# EAGLE design PCRADIO-1 (EAGLE 4.15)

## Sheet 1 of 3
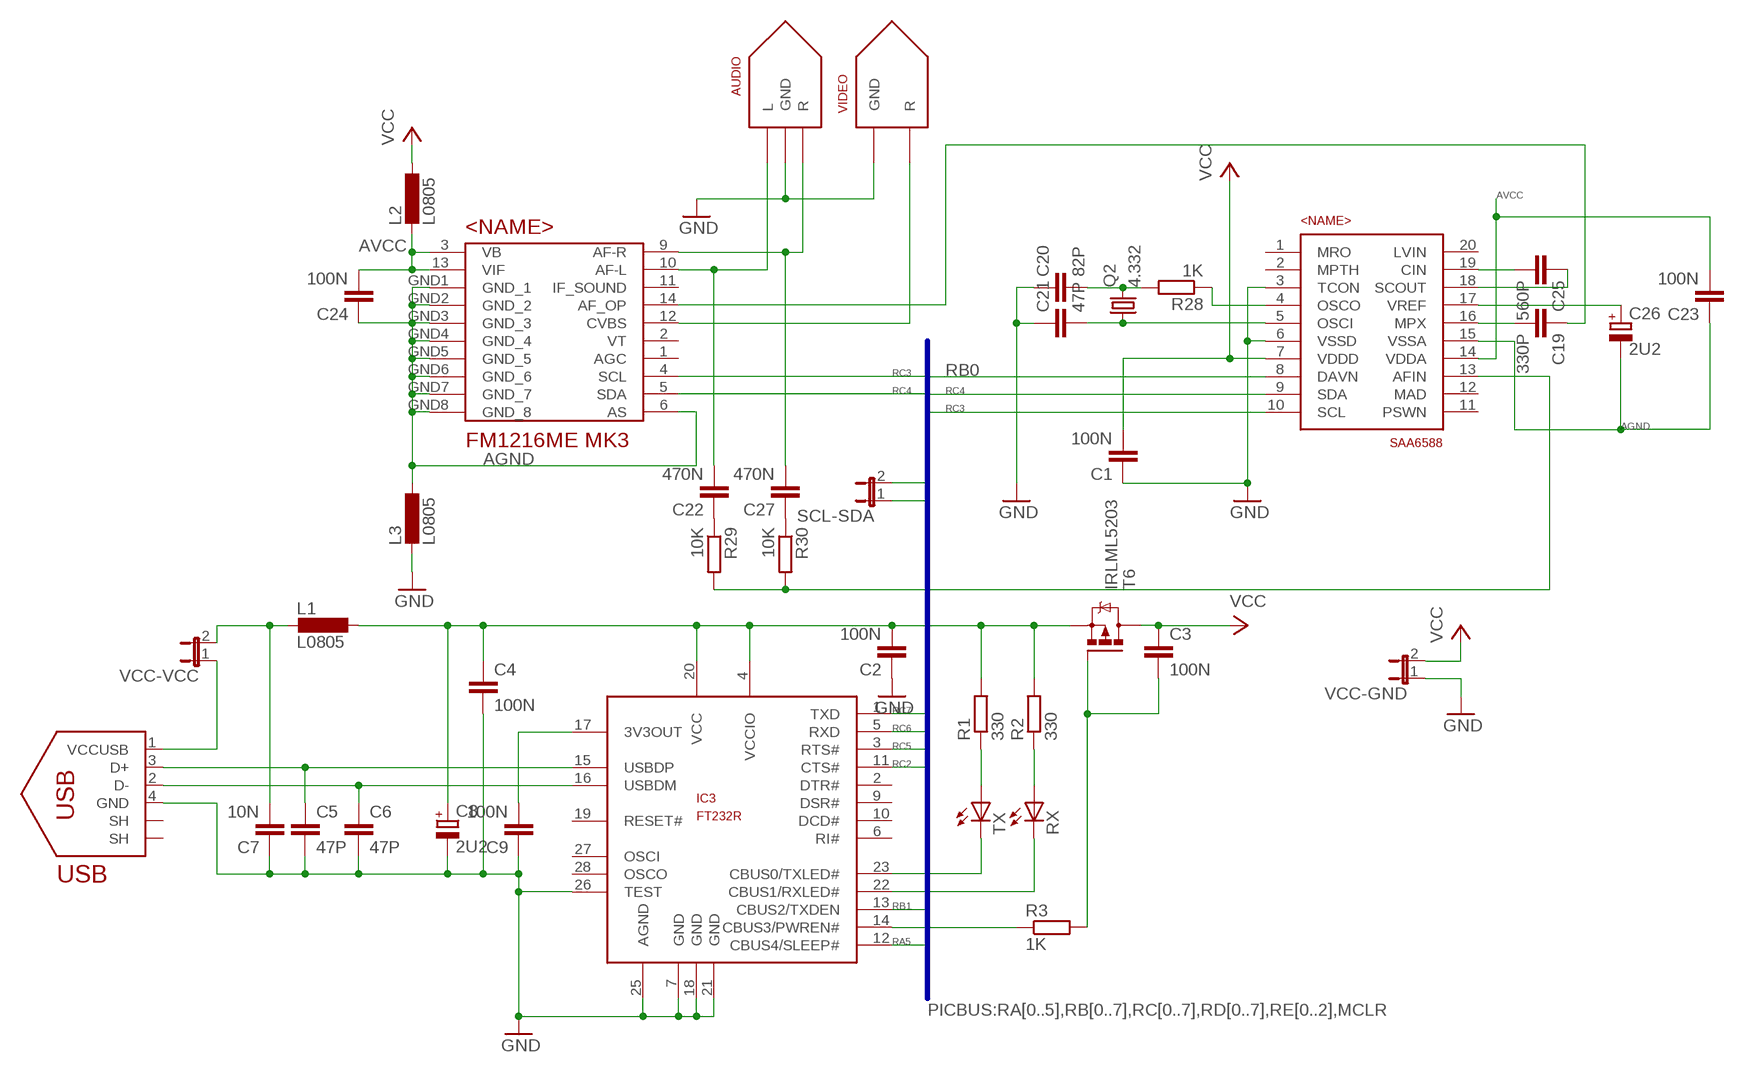
[diagram p0: schematic, sheet 1]

### Parts
AUDIO  STEREOKLINKE  [STEREOKLINKE_3,5_SMD]
C1  100N  C-EUC0805  [C0805]
C2  100N  C-EUC0805  [C0805]
C3  100N  C-EUC0805  [C0805]
C4  100N  C-EUC0805  [C0805]
C5  47P  C-EUC0805  [C0805]
C6  47P  C-EUC0805  [C0805]
C7  10N  C-EUC0805  [C0805]
C8  2U2  CPOL-EUB/3528-21R  [B/3528-21R]
C9  100N  C-EUC0805  [C0805]
C19  330P  C-EUC0805  [C0805]
C20  82P  C-EUC0805  [C0805]
C21  47P  C-EUC0805  [C0805]
C22  470N  C-EUC0805  [C0805]
C23  100N  C-EUC0805  [C0805]
C24  100N  C-EUC0805  [C0805]
C25  560P  C-EUC0805  [C0805]
C26  2U2  CPOL-EUB/3528-21R  [B/3528-21R]
C27  470N  C-EUC0805  [C0805]
IC3  FT232R  [SSOP28]
IC4  SAA6588  [SO20W]
IC5  FM1216MEMK3  [FM1200MK3]
L1  L0805  [C0805]
L2  L0805  [C0805]
L3  L0805  [C0805]
Q2  4.332  CRYTALHC49S  [HC49/S]
R1  330  R-EU_M0805  [M0805]
R2  330  R-EU_M0805  [M0805]
R3  1K  R-EU_M0805  [M0805]
R28  1K  R-EU_M0805  [M0805]
R29  10K  R-EU_M0805  [M0805]
R30  10K  R-EU_M0805  [M0805]
RX  LEDCHIP-LED0805  [CHIP-LED0805]
SCL-SDA  JP1E  [JP1]
T6  IRLML5203  [MICRO3]
TX  LEDCHIP-LED0805  [CHIP-LED0805]
USB  USBCONN  [PN61729]
VCC-GND  JP1E  [JP1]
VCC-VCC  JP1E  [JP1]
VIDEO  CINCHSMALL  [CINCH2]

### Nets
AGND: C23.1 C24.1 C26.- IC4.15(VSSA) IC5.6(AS) IC5.GND1(GND_1) IC5.GND2(GND_2) IC5.GND3(GND_3) IC5.GND4(GND_4) IC5.GND5(GND_5) IC5.GND6(GND_6) IC5.GND7(GND_7) IC5.GND8(GND_8) L3.1
AVCC: C23.2 C24.2 IC4.14(VDDA) IC5.3(VB) IC5.13(VIF) L2.2
GND: AUDIO.P$G(GND) C1.1 C2.1 C4.2 C5.2 C6.2 C7.1 C8.- C9.1 C20.1 C21.1 IC3.7(GND) IC3.18(GND) IC3.21(GND) IC3.25(AGND) IC3.26(TEST) IC4.3(TCON) IC4.6(VSSD) L3.2 USB.4(GND) VCC-GND.1 VIDEO.P$1(GND) ; also sheet 2,3
N$1: C5.1 IC3.15(USBDP) USB.3(D+)
N$3: C7.2 L1.2 VCC-VCC.2
N$4: IC3.14(CBUS3/PWREN#) R3.1
N$5: C9.2 IC3.17(3V3OUT)
N$8: C3.2 R3.2 T6.1(G)
N$12: R1.1 TX.A
N$13: R2.1 RX.A
N$14: IC3.23(CBUS0/TXLED#) TX.C
N$15: IC3.22(CBUS1/RXLED#) RX.C
N$24: USB.1(VCCUSB) VCC-VCC.1
N$25: C19.2 IC4.16(MPX)
N$26: C6.1 IC3.16(USBDM) USB.2(D-)
N$27: C19.1 IC5.14(AF_OP)
N$28: C20.2 Q2.2 R28.2
N$29: AUDIO.P$R(R) C27.2 IC5.9(AF-R)
N$30: AUDIO.P$L(L) C22.2 IC5.10(AF-L)
N$31: IC5.12(CVBS) VIDEO.P$2(R)
N$32: C21.2 IC4.5(OSCI) Q2.1
N$33: IC4.4(OSCO) R28.1
N$36: C26.+ IC4.17(VREF)
N$38: C25.2 IC4.19(CIN)
N$39: C25.1 IC4.18(SCOUT)
N$40: C22.1 R29.1
N$41: C27.1 R30.1
N$42: IC4.13(AFIN) R29.2 R30.2
RA5: IC3.12(CBUS4/SLEEP#) ; also sheet 2
RB0: IC4.8(DAVN) ; also sheet 2
RB1: IC3.13(CBUS2/TXDEN) ; also sheet 2
RC2: IC3.11(CTS#) ; also sheet 2
RC3: IC4.10(SCL) IC5.4(SCL) SCL-SDA.1 ; also sheet 2
RC4: IC4.9(SDA) IC5.5(SDA) SCL-SDA.2 ; also sheet 2
RC5: IC3.3(RTS#) ; also sheet 2
RC6: IC3.5(RXD) ; also sheet 2
RC7: IC3.1(TXD) ; also sheet 2
VCC: C1.2 C3.1 IC4.7(VDDD) L2.1 T6.3(D) VCC-GND.2 ; also sheet 2
VCCUSB: C2.2 C4.1 C8.+ IC3.4(VCCIO) IC3.20(VCC) L1.1 R1.2 R2.2 T6.2(S)
Unconnected: IC3.2(DTR#) IC3.6(RI#) IC3.9(DSR#) IC3.10(DCD#) IC3.19(RESET#) IC3.27(OSCI) IC3.28(OSCO) IC4.1(MRO) IC4.2(MPTH) IC4.11(PSWN) IC4.12(MAD) IC4.20(LVIN) IC5.1(AGC) IC5.2(VT) IC5.11(IF_SOUND) USB.SHIELD1(SH) USB.SHIELD2(SH)

### Buses
PICBUS:RA[0..5],RB[0..7],RC[0..7],RD[0..7],RE[0..2],MCLR

## Sheet 2 of 3
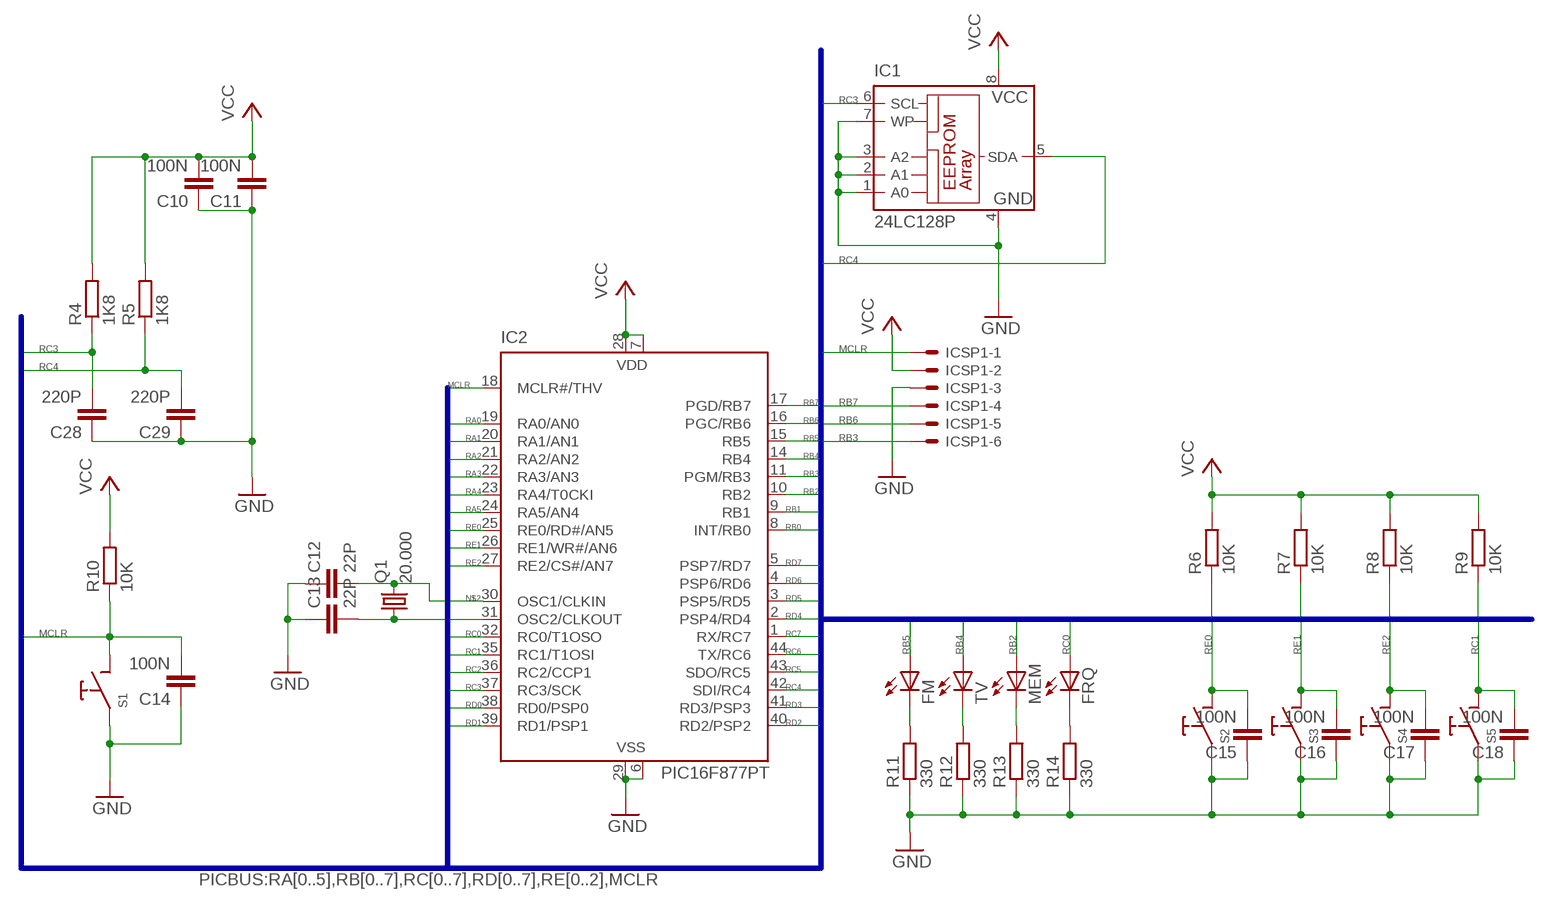
[diagram p1: schematic, sheet 2]

### Parts
C10  100N  C-EUC0805  [C0805]
C11  100N  C-EUC0805  [C0805]
C12  22P  C-EUC0805  [C0805]
C13  22P  C-EUC0805  [C0805]
C14  100N  C-EUC0805  [C0805]
C15  100N  C-EUC0805  [C0805]
C16  100N  C-EUC0805  [C0805]
C17  100N  C-EUC0805  [C0805]
C18  100N  C-EUC0805  [C0805]
C28  220P  C-EUC0805  [C0805]
C29  220P  C-EUC0805  [C0805]
FM  LEDCHIP-LED0805  [CHIP-LED0805]
FRQ  LEDCHIP-LED0805  [CHIP-LED0805]
IC1  24LC128P  [DIL8]
IC2  PIC16F877PT  [TQFP44]
ICSP1  53048-06  [53048-06]
MEM  LEDCHIP-LED0805  [CHIP-LED0805]
Q1  20.000  CRYTALHC49S  [HC49/S]
R4  1K8  R-EU_R0805  [R0805]
R5  1K8  R-EU_R0805  [R0805]
R6  10K  R-EU_R0805  [R0805]
R7  10K  R-EU_R0805  [R0805]
R8  10K  R-EU_R0805  [R0805]
R9  10K  R-EU_R0805  [R0805]
R10  10K  R-EU_R0805  [R0805]
R11  330  R-EU_M0805  [M0805]
R12  330  R-EU_M0805  [M0805]
R13  330  R-EU_M0805  [M0805]
R14  330  R-EU_M0805  [M0805]
S1  TASTER  [TASTER01]
S2  TASTER  [TASTER01]
S3  TASTER  [TASTER01]
S4  TASTER  [TASTER01]
S5  TASTER  [TASTER01]
TV  LEDCHIP-LED0805  [CHIP-LED0805]

### Nets
FREQ: FRQ.C R14.2
GND: C10.1 C11.1 C12.1 C13.1 C14.1 C15.1 C16.1 C17.1 C18.1 C28.1 C29.1 IC1.1(A0) IC1.2(A1) IC1.3(A2) IC1.4(GND) IC1.7(WP) IC2.6(VSS) IC2.29(VSS) ICSP1.3 R11.1 R12.1 R13.1 R14.1 S1.S1 S2.S1 S3.S1 S4.S1 S5.S1 ; also sheet 1,3
MCLR: C14.2 IC2.18(MCLR#/THV) ICSP1.1 R10.1 S1.S2
N$2: C12.2 IC2.30(OSC1/CLKIN) Q1.2
N$21: FM.C R11.2
N$22: R12.2 TV.C
N$23: MEM.C R13.2
N$34: C13.2 IC2.31(OSC2/CLKOUT) Q1.1
RA0: IC2.19(RA0/AN0) ; also sheet 3
RA1: IC2.20(RA1/AN1) ; also sheet 3
RA2: IC2.21(RA2/AN2) ; also sheet 3
RA3: IC2.22(RA3/AN3) ; also sheet 3
RA4: IC2.23(RA4/T0CKI) ; also sheet 3
RA5: IC2.24(RA5/AN4) ; also sheet 1
RB0: IC2.8(INT/RB0) ; also sheet 1
RB1: IC2.9(RB1) ; also sheet 1
RB2: IC2.10(RB2) MEM.A
RB3: IC2.11(PGM/RB3) ICSP1.6
RB4: IC2.14(RB4) TV.A
RB5: FM.A IC2.15(RB5)
RB6: IC2.16(PGC/RB6) ICSP1.5
RB7: IC2.17(PGD/RB7) ICSP1.4
RC0: FRQ.A IC2.32(RC0/T1OSO)
RC1: C18.2 IC2.35(RC1/T1OSI) R9.1 S5.S2
RC2: IC2.36(RC2/CCP1) ; also sheet 1
RC3: C28.2 IC1.6(SCL) IC2.37(RC3/SCK) R4.1 ; also sheet 1
RC4: C29.2 IC1.5(SDA) IC2.42(SDI/RC4) R5.1 ; also sheet 1
RC5: IC2.43(SDO/RC5) ; also sheet 1
RC6: IC2.44(TX/RC6) ; also sheet 1
RC7: IC2.1(RX/RC7) ; also sheet 1
RD0: IC2.38(RD0/PSP0) ; also sheet 3
RD1: IC2.39(RD1/PSP1) ; also sheet 3
RD2: IC2.40(RD2/PSP2) ; also sheet 3
RD3: IC2.41(RD3/PSP3) ; also sheet 3
RD4: IC2.2(PSP4/RD4) ; also sheet 3
RD5: IC2.3(PSP5/RD5) ; also sheet 3
RD6: IC2.4(PSP6/RD6) ; also sheet 3
RD7: IC2.5(PSP7/RD7) ; also sheet 3
RE0: C15.2 IC2.25(RE0/RD#/AN5) R6.1 S2.S2
RE1: C16.2 IC2.26(RE1/WR#/AN6) R7.1 S3.S2
RE2: C17.2 IC2.27(RE2/CS#/AN7) R8.1 S4.S2
VCC: C10.2 C11.2 IC1.8(VCC) IC2.7(VDD) IC2.28(VDD) ICSP1.2 R4.2 R5.2 R6.2 R7.2 R8.2 R9.2 R10.2 ; also sheet 1

### Buses
PICBUS:RA[0..5],RB[0..7],RC[0..7],RD[0..7],RE[0..2],MCLR

## Sheet 3 of 3
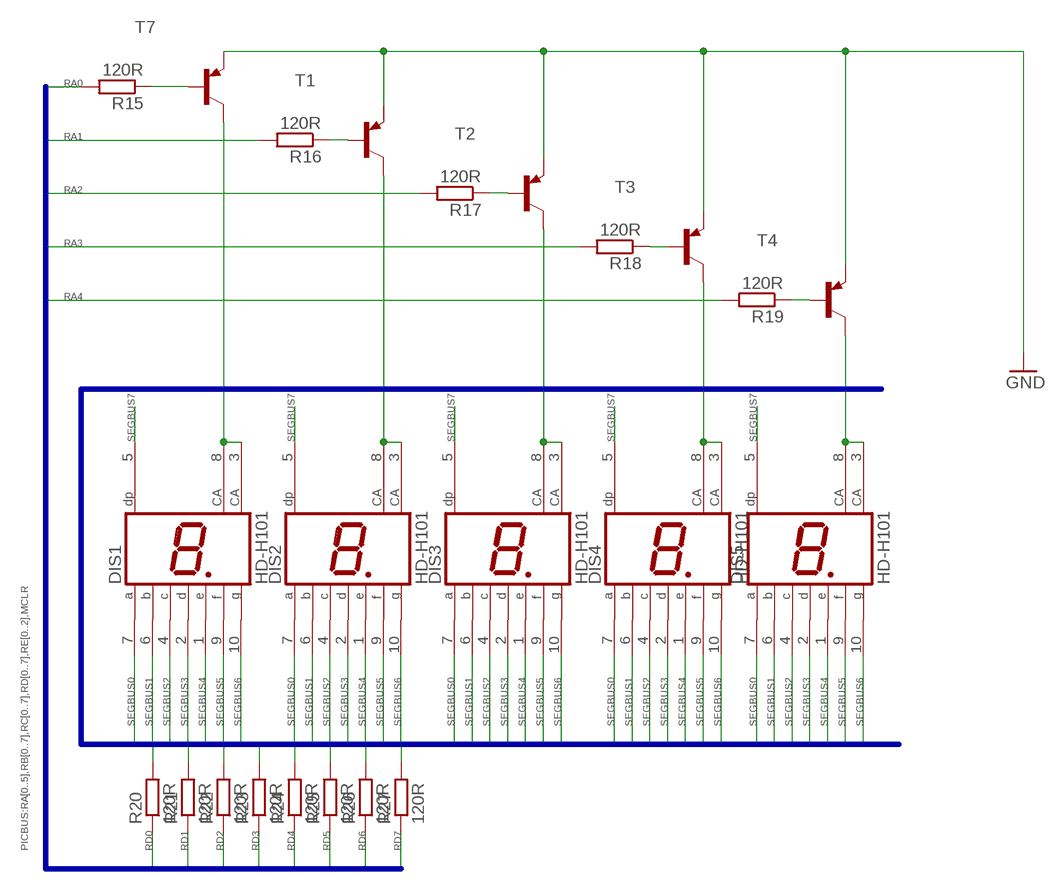
[diagram p2: schematic, sheet 3]

### Parts
DIS1  HD-H101  [HDSP-M]
DIS2  HD-H101  [HDSP-M]
DIS3  HD-H101  [HDSP-M]
DIS4  HD-H101  [HDSP-M]
DIS5  HD-H101  [HDSP-M]
R15  120R  R-EU_M0805  [M0805]
R16  120R  R-EU_M0805  [M0805]
R17  120R  R-EU_M0805  [M0805]
R18  120R  R-EU_M0805  [M0805]
R19  120R  R-EU_M0805  [M0805]
R20  120R  R-EU_M0805  [M0805]
R21  120R  R-EU_M0805  [M0805]
R22  120R  R-EU_M0805  [M0805]
R23  120R  R-EU_M0805  [M0805]
R24  120R  R-EU_M0805  [M0805]
R25  120R  R-EU_M0805  [M0805]
R26  120R  R-EU_M0805  [M0805]
R27  120R  R-EU_M0805  [M0805]
T1  BC857A-PNP-SOT23-BEC  [SOT23-BEC]
T2  BC857A-PNP-SOT23-BEC  [SOT23-BEC]
T3  BC857A-PNP-SOT23-BEC  [SOT23-BEC]
T4  BC857A-PNP-SOT23-BEC  [SOT23-BEC]
T7  BC857A-PNP-SOT23-BEC  [SOT23-BEC]

### Nets
GND: T1.E T2.E T3.E T4.E T7.E ; also sheet 1,2
N$6: R15.1 T7.B
N$7: R16.1 T1.B
N$9: R17.1 T2.B
N$10: R18.1 T3.B
N$11: R19.1 T4.B
N$16: DIS1.3(CA) DIS1.8(CA) T7.C
N$17: DIS2.3(CA) DIS2.8(CA) T1.C
N$18: DIS3.3(CA) DIS3.8(CA) T2.C
N$19: DIS4.3(CA) DIS4.8(CA) T3.C
N$20: DIS5.3(CA) DIS5.8(CA) T4.C
RA0: R15.2 ; also sheet 2
RA1: R16.2 ; also sheet 2
RA2: R17.2 ; also sheet 2
RA3: R18.2 ; also sheet 2
RA4: R19.2 ; also sheet 2
RD0: R20.1 ; also sheet 2
RD1: R21.1 ; also sheet 2
RD2: R22.1 ; also sheet 2
RD3: R23.1 ; also sheet 2
RD4: R24.1 ; also sheet 2
RD5: R25.1 ; also sheet 2
RD6: R26.1 ; also sheet 2
RD7: R27.1 ; also sheet 2
SEGBUS0: DIS1.7(A) DIS2.7(A) DIS3.7(A) DIS4.7(A) DIS5.7(A) R20.2
SEGBUS1: DIS1.6(B) DIS2.6(B) DIS3.6(B) DIS4.6(B) DIS5.6(B) R21.2
SEGBUS2: DIS1.4(C) DIS2.4(C) DIS3.4(C) DIS4.4(C) DIS5.4(C) R22.2
SEGBUS3: DIS1.2(D) DIS2.2(D) DIS3.2(D) DIS4.2(D) DIS5.2(D) R23.2
SEGBUS4: DIS1.1(E) DIS2.1(E) DIS3.1(E) DIS4.1(E) DIS5.1(E) R24.2
SEGBUS5: DIS1.9(F) DIS2.9(F) DIS3.9(F) DIS4.9(F) DIS5.9(F) R25.2
SEGBUS6: DIS1.10(G) DIS2.10(G) DIS3.10(G) DIS4.10(G) DIS5.10(G) R26.2
SEGBUS7: DIS1.5(DP) DIS2.5(DP) DIS3.5(DP) DIS4.5(DP) DIS5.5(DP) R27.2

### Buses
PICBUS:RA[0..5],RB[0..7],RC[0..7],RD[0..7],RE[0..2],MCLR
SEGBUS[0..7]

## Library data of the parts
AUDIO = turbod3:STEREOKLINKE
C1-C7 C9 C19 C22-C25 C27 = rcl:C-EU: CAPACITOR, European symbol
C8 C26 = rcl:CPOL-EU: POLARIZED CAPACITOR, European symbol
C10-C18 C20 C21 C28 C29 = turbod3:C-EU: CAPACITOR, European symbol
DIS1-DIS5 = display-hp:HD-H101: LED DISPLAY 1-character 7 segment, decimal point right
FM FRQ MEM RX TV TX = led:LED: LED OSRAM: - CHIPLED LG R971, LG N971, LY N971, LG Q971, LY Q971, LO R971, LY R971 LH N974, LH R974 LS Q976, LO Q976, LY Q976 LO Q996 - Hyper CHIPLED LW Q18S LB Q993, LB Q99A, LB R99A - SideLED LS A670, LO A670, LY A670, LG A670, LP A670 LB A673, LV A673, LT A673, LW A673 LH A674 LY A675 LS A676, LA A676, LO A676, LY A676, LW A676 LS A679, LY A679, LG A679 - Hyper Micro SIDELED® LS Y876, LA Y876, LO Y876, LY Y876 LT Y87S - SmartLED LW L88C, LW L88S LB L89C, LB L89S, LG L890 LS L89K, LO L89K, LY L89K LS L896, LA L896, LO L896, LY L896 - TOPLED LS T670, LO T670, LY T670, LG T670, LP T670 LSG T670, LSP T670, LSY T670, LOP T670, LYG T670 LG T671, LOG T671, LSG T671 LB T673, LV T673, LT T673, LW T673 LH T674 LS T676, LA T676, LO T676, LY T676, LB T676, LH T676, LSB T676, LW T676 LB T67C, LV T67C, LT T67C, LS T67K, LO T67K, LY T67K, LW E67C LS E67B, LA E67B, LO E67B, LY E67B, LB E67C, LV E67C, LT E67C LW T67C LS T679, LY T679, LG T679 LS T770, LO T770, LY T770, LG T770, LP T770 LB T773, LV T773, LT T773, LW T773 LH T774 LS E675, LA E675, LY E675, LS T675 LS T776, LA T776, LO T776, LY T776, LB T776 LHGB T686 LT T68C, LB T68C - Hyper Mini TOPLED® LB M676 - Mini TOPLED Santana® LG M470 LS M47K, LO M47K, LY M47K Source: http://www.osram.convergy.de/
IC1 = microchip:24*: Serial EEPROM I2C
IC2 = microchip:PIC16F87*: MICROCONTROLLER
IC3 = turbod3:FT232R
IC4 = turbod3:SAA6588
IC5 = turbod3:FM1216MEMK3
ICSP1 = con-molex:53?-06: CONNECTOR wire to board 1.25 mm (.049 inch) pitch header
L1-L3 = turbod3:L
Q1 Q2 = turbod3:CRYTAL: CRYSTAL
R1-R30 = rcl:R-EU_: RESISTOR, European symbol
S1-S5 = turbod3:TASTER
SCL-SDA VCC-GND VCC-VCC = jumper:JP1E: JUMPER
T1-T4 T7 = transistor:*-PNP-: PNP Transistror
T6 = transistor-power:IRLML5203: HEXFET P-Channel Power MOSFET
USB = turbod3:USBCONN
VIDEO = turbod3:CINCH

## Net classes
0 default: width 0.3 mm

## Board
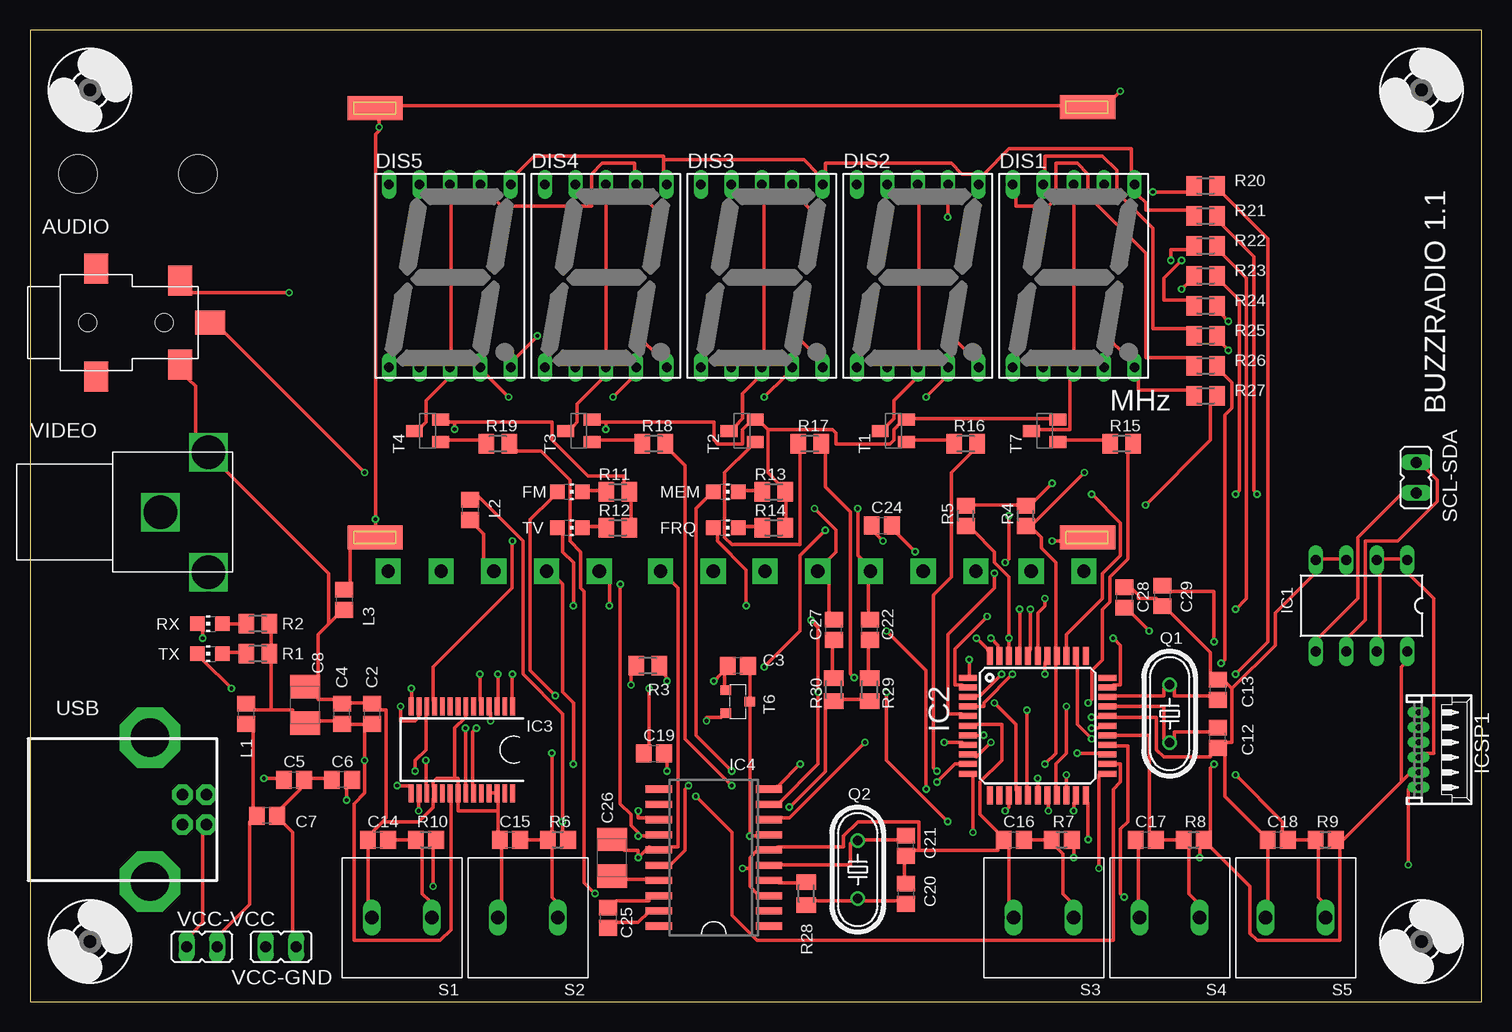
[diagram p3: board, top side]
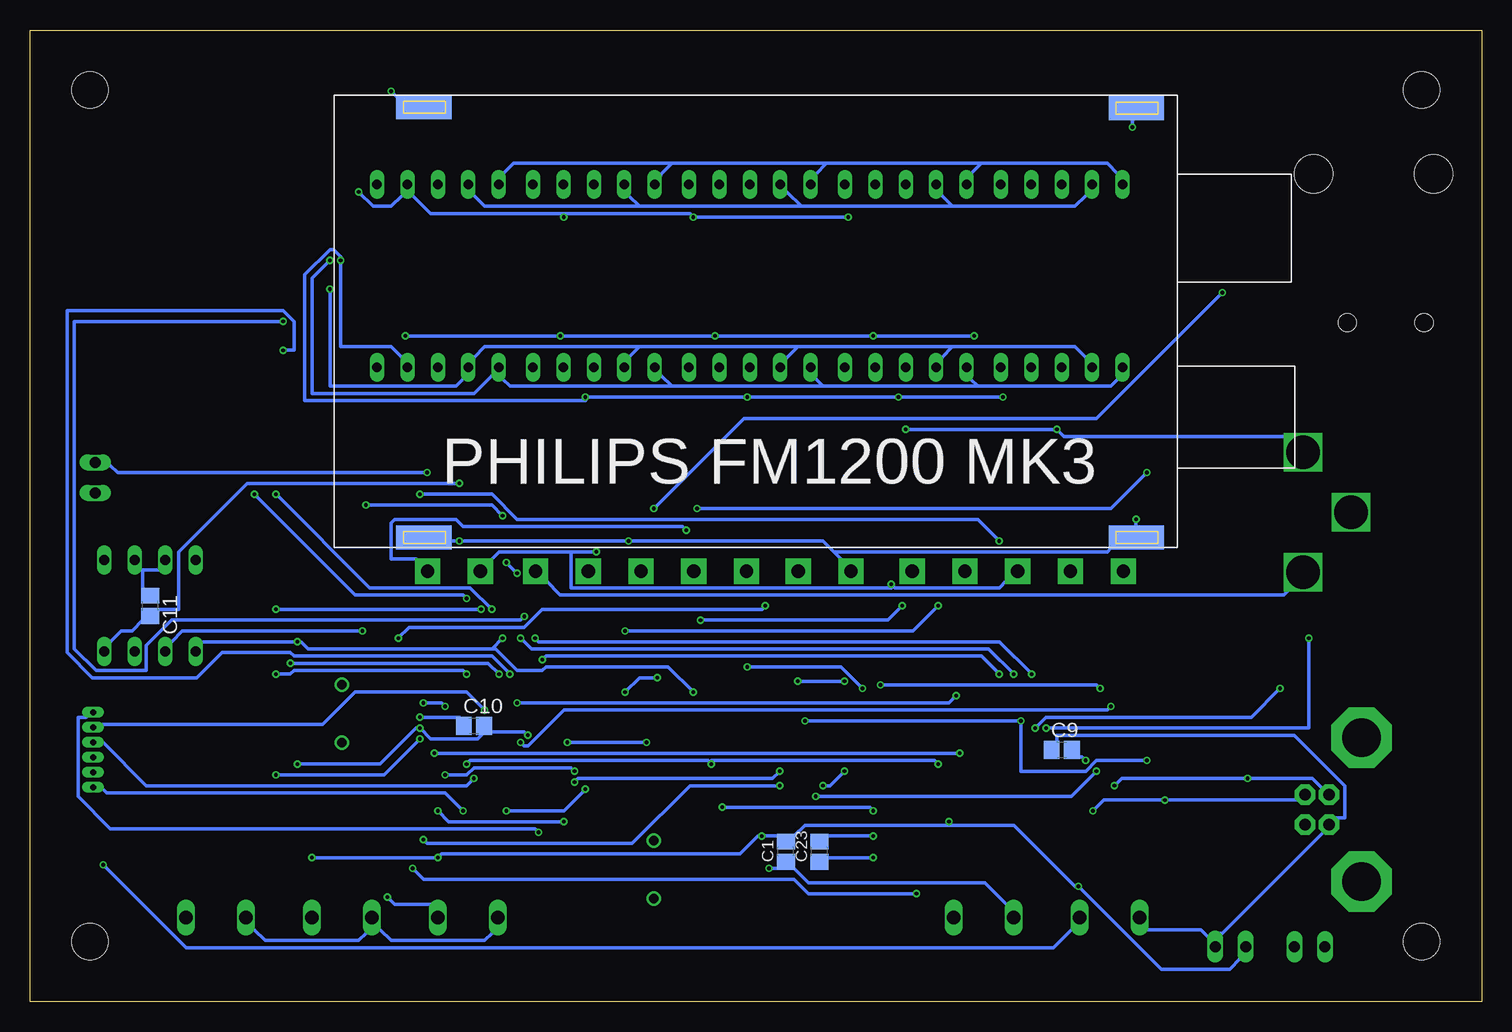
[diagram p4: board, bottom side, seen from below]

Size 121 x 81 mm. Coordinates in mm from the lower left corner, seen from the top.
Outline: 0,0 121,0 121,81 0,81 0,0
Copper layers (1*16): Top 0.035mm / dielectric 1.5mm / Bottom 0.035mm
Design rules "PCB-POOL": minimum track width 6mil, minimum drill 12mil, track to track 6mil, track to pad 6mil, pad to pad 6mil, via to via 6mil, smd to smd 6mil, copper to edge 20mil, drill to drill 8mil, minimum pad ring 8mil, minimum via ring 6mil, stop-mask expansion 3mil, vias tented up to drill 0mil, thermal gap 8mil
Holes 3.2 mm at 4,69 14,69

### Footprints (pad centres in the part's own frame; a part is rotated, then mirrored left to right if it is on the bottom)
STEREOKLINKE_3,5_SMD = smd 2 x 2.5: P$G 10,-3.5; P$L 10,3.5; S@1 3,4.5; S@2 3,-4.5 | smd 2.5 x 2: P$R 12.5,0 | hole 1.5: 2.3,0; 8.7,0
C0805 = smd 1.3 x 1.5: 1 -0.85,0; 2 0.85,0
B/3528-21R = smd 1.95 x 2.5: + 1.525,0; - -1.525,0
HDSP-M = drill 0.813 long: 1 -5.08,-7.62; 2 -2.54,-7.62; 3 0,-7.62; 4 2.54,-7.62; 5 5.08,-7.62; 6 5.08,7.62; 7 2.54,7.62; 8 0,7.62; 9 -2.54,7.62; 10 -5.08,7.62
CHIP-LED0805 = smd 1.2 x 1.2: A 0,-1.05; C 0,1.05
DIL8 = drill 0.813 long: 1 -3.81,-3.81; 2 -1.27,-3.81; 3 1.27,-3.81; 4 3.81,-3.81; 5 3.81,3.81; 6 1.27,3.81; 7 -1.27,3.81; 8 -3.81,3.81
TQFP44 = smd 1.5 x 0.5: 1 -5.8,4; 2 -5.8,3.2; 3 -5.8,2.4; 4 -5.8,1.6; 5 -5.8,0.8; 6 -5.8,0; 7 -5.8,-0.8; 8 -5.8,-1.6; 9 -5.8,-2.4; 10 -5.8,-3.2; 11 -5.8,-4; 23 5.8,-4; 24 5.8,-3.2; 25 5.8,-2.4; 26 5.8,-1.6; 27 5.8,-0.8; 28 5.8,0; 29 5.8,0.8; 30 5.8,1.6; 31 5.8,2.4; 32 5.8,3.2; 33 5.8,4 | smd 0.5 x 1.5: 12 -4,-5.8; 13 -3.2,-5.8; 14 -2.4,-5.8; 15 -1.6,-5.8; 16 -0.8,-5.8; 17 0,-5.8; 18 0.8,-5.8; 19 1.6,-5.8; 20 2.4,-5.8; 21 3.2,-5.8; 22 4,-5.8; 34 4,5.8; 35 3.2,5.8; 36 2.4,5.8; 37 1.6,5.8; 38 0.8,5.8; 39 0,5.8; 40 -0.8,5.8; 41 -1.6,5.8; 42 -2.4,5.8; 43 -3.2,5.8; 44 -4,5.8
SSOP28 = smd 0.4 x 1.5: 1 -4.225,-3.625; 2 -3.575,-3.625; 3 -2.925,-3.625; 4 -2.275,-3.625; 5 -1.625,-3.625; 6 -0.975,-3.625; 7 -0.325,-3.625; 8 0.325,-3.625; 9 0.975,-3.625; 10 1.625,-3.625; 11 2.275,-3.625; 12 2.925,-3.625; 13 3.575,-3.625; 14 4.225,-3.625; 15 4.225,3.625; 16 3.575,3.625; 17 2.925,3.625; 18 2.275,3.625; 19 1.625,3.625; 20 0.975,3.625; 21 0.325,3.625; 22 -0.325,3.625; 23 -0.975,3.625; 24 -1.625,3.625; 25 -2.275,3.625; 26 -2.925,3.625; 27 -3.575,3.625; 28 -4.225,3.625
SO20W = smd 0.6 x 2.2: 1 -5.715,-4.6; 2 -4.445,-4.6; 3 -3.175,-4.6; 4 -1.905,-4.6; 5 -0.635,-4.6; 6 0.635,-4.6; 7 1.905,-4.6; 8 3.175,-4.6; 9 4.445,-4.6; 10 5.715,-4.6; 11 5.715,4.6; 12 4.445,4.6; 13 3.175,4.6; 14 1.905,4.6; 15 0.635,4.6; 16 -0.635,4.6; 17 -1.905,4.6; 18 -3.175,4.6; 19 -4.445,4.6; 20 -5.715,4.6
FM1200MK3 = drill 1.1 pad 2.1 square: 1 -15.14,14.63; 2 -10.74,14.63; 3 -6.34,14.63; 4 -1.94,14.63; 5 2.46,14.63; 6 7.56,14.63; 7 11.96,14.63; 8 16.26,14.63; 9 20.66,14.63; 10 25.06,14.63; 11 29.46,14.63; 12 33.86,14.63; 13 38.46,14.63; 14 42.86,14.63 | smd 4.6 x 2 bottom: GND1 -16.24,11.83; GND3 43.16,11.83; GND5 -16.24,-23.97; GND7 43.16,-24.07 | smd 4.6 x 2: GND2 -16.24,11.83; GND4 43.16,11.83; GND6 -16.24,-23.97; GND8 43.16,-24.07
53048-06 = drill 0.5 pad 0.698 long: 1 3.125,-1.25; 2 1.875,-1.25; 3 0.625,-1.25; 4 -0.625,-1.25; 5 -1.875,-1.25; 6 -3.125,-1.25
HC49/S = drill 0.813 round: 1 -2.413,0; 2 2.413,0
M0805 = smd 1.3 x 1.6: 1 -0.95,0; 2 0.95,0
R0805 = smd 1.3 x 1.5: 1 -0.85,0; 2 0.85,0
TASTER01 = drill 1.1 long: S1 -2.5,0; S2 2.5,0
JP1 = drill 0.914 long: 1 0,-1.27; 2 0,1.27
SOT23-BEC = smd 1 x 1.4: B -0.95,-1.1; C 0,1.1; E 0.95,-1.1
MICRO3 = smd 0.8 x 0.9: 1 -0.95,-1; 2 0.95,-1; 3 0,1
3,0 = hole 3: 0,0
PN61729 = drill 0.95 pad 1.676 octagon: 1 1.25,4.71; 2 -1.25,4.71; 3 -1.25,2.71; 4 1.25,2.71 | drill 3.2 pad 5.08 octagon: SHIELD1 -6,0; SHIELD2 6,0
CINCH2 = drill 2.8 square: P$1 8,5; P$2 8,-5; P$3 4,0

### Placement (x,y rotation side)
AUDIO  2.5,56.61 0 top
C1  58,12.5 90 bottom
C2  28.5,24 270 top
C3  59,28 180 top
C4  26,24 90 top
C5  22,18.5 0 top
C6  26,18.5 180 top
C7  19.75,15.5 180 top
C8  22.92,24.73 270 top
C9  35,21 0 bottom
C10  84,23 0 bottom
C11  111,33 270 bottom
C12  99,22 90 top
C13  99,26 270 top
C14  29,13.5 0 top
C15  40,13.5 0 top
C16  82,13.5 0 top
C17  93,13.5 0 top
C18  104,13.5 0 top
C19  52,20.69 0 top
C20  73,9 270 top
C21  73,13 90 top
C22  70,31 90 top
C23  55.19,12.5 90 bottom
C24  71,39.69 0 top
C25  48.19,7 270 top
C26  48.5,12 270 top
C27  67,31 90 top
C28  91.21,33.69 270 top
C29  94.41,33.81 90 top
DIS1  87,60.5 0 top
DIS2  74,60.5 0 top
DIS3  61,60.5 0 top
DIS4  48,60.5 0 top
DIS5  35,60.5 0 top
FM  45,42.5 270 top
FRQ  58,39.5 270 top
IC1  111,33 180 top
IC2  84,23 0 top
IC3  36,21 180 top
IC4  57,12 90 top
IC5  45,50.5 180 bottom
ICSP1  117,21 270 top
L1  18,24 270 top
L2  36.69,41 270 top
L3  26.19,33.5 270 top
MEM  58,42.5 270 top
Q1  95,24 270 top
Q2  69,11 270 top
R1  19,29 0 top
R2  19,31.5 0 top
R3  51.5,28 0 top
R4  83,40.5 90 top
R5  78,40.5 90 top
R6  44,13.5 0 top
R7  86,13.5 0 top
R8  97,13.5 0 top
R9  108,13.5 0 top
R10  33,13.5 0 top
R11  49,42.5 180 top
R12  49,39.5 180 top
R13  62,42.5 180 top
R14  62,39.5 180 top
R15  91,46.5 0 top
R16  78,46.5 0 top
R17  65,46.5 0 top
R18  52,46.5 0 top
R19  39,46.5 0 top
R20  98,68 180 top
R21  98,65.5 180 top
R22  98,63 180 top
R23  98,60.5 180 top
R24  98,58 180 top
R25  98,55.5 180 top
R26  98,53 180 top
R27  98,50.5 180 top
R28  64.71,9 270 top
R29  70,26 270 top
R30  67,26 270 top
RX  15,31.5 90 top
S1  31,7 0 top
S2  41.5,7 0 top
S3  84.5,7 0 top
S4  95,7 0 top
S5  105.5,7 0 top
SCL-SDA  115.56,43.67 180 top
T1  71.97,47.58 90 top
T2  59.36,47.58 90 top
T3  45.75,47.58 90 top
T4  33.14,47.58 90 top
T6  59,25 270 top
T7  84.58,47.58 90 top
TV  45,39.5 270 top
TX  15,29 90 top
U$5  [3,0]  5,76 0 top
U$6  [3,0]  116,76 0 top
U$7  [3,0]  116,5 0 top
U$8  [3,0]  5,5 0 top
USB  10,16 270 top
VCC-GND  20.92,4.57 90 top
VCC-VCC  14.33,4.56 270 top
VIDEO  6.89,40.8 0 top

### Tracks (layer width: path | path; a pad name or v marks a point on that pad's centre or on a via)
AGND  (via drill 0.3)
  Top 0.3: C26.- 49.5,12.6 50.7,12.6 v50.7,12 51.6,12.9 IC4.15 53.4,12.9 54,12.9 54,34.5 53.4,35.1 IC5.6 | v71.1,38.4 70.5,39 C24.1 | v85.2,38.4 86.1,38.4 IC5.GND4 | v90.9,75.9 90.3,75.3 IC5.GND8 86.1,74.7 30.9,74.7 IC5.GND6 29.1,73.5 v29.1,72.9 29.1,72.6 28.8,72.3 v28.8,40.2 28.8,39.6 IC5.GND2 26.7,37.8 26.7,34.8 L3.1
  Bottom 0.3: v50.7,12 54.6,12 C23.1 | IC5.GND4 86.1,38.4 v85.2,38.4 v71.1,38.4 54.9,38.4 54,37.5 | 54,37.5 53.4,36.9 IC5.6 | 54,37.5 31.2,37.5 30.9,37.8 IC5.GND2 28.8,39.6 v28.8,40.2 | v90.9,75.9 90.3,75.3 IC5.GND8 | v29.1,72.9 29.1,73.5 IC5.GND6
AVCC  (via drill 0.3)
  Top 0.3: v73.8,37.5 72.3,39 C24.2 | IC4.14 51.6,13.8 v50.7,13.8 50.7,14.1 50.1,14.7 50.1,15.6 49.2,16.5 v49.2,34.8 | L2.2 37.2,39.6 37.8,39 37.8,36.9 IC5.3
  Bottom 0.3: 75.9,37.5 81.9,37.5 82.5,36.9 IC5.13 | 75.9,37.5 v73.8,37.5 | v50.7,13.8 54.6,13.8 C23.2 | IC5.3 39.6,35.1 40.2,34.5 48.9,34.5 v49.2,34.8 49.2,34.5 75.9,34.5 75.9,37.5
FREQ
  Top 0.3: FRQ.C 59.4,39.6 60.6,39.6 R14.2
GND  (via drill 0.3)
  Top 0.3: C17.1 92.4,12.9 92.4,8.4 S4.S1 | 60,11.1 60,12 60.6,12.6 IC4.6 62.4,12.9 67.8,12.9 67.8,13.8 69,15 74.1,15 74.1,12.6 | 60,11.1 60,9.6 60.6,9 IC4.3 | C20.1 72.9,10.2 72.9,11.7 C21.1 73.5,12.6 74.1,12.6 | C16.1 81.6,12.9 81.6,8.4 S3.S1 | IC2.6 78.9,23.1 81,23.1 81,20.1 79.2,18.3 79.2,15.6 80.7,14.1 C16.1 | 74.1,12.6 80.7,12.6 80.7,12.9 C16.1 | IC1.3 109.2,36.9 107.7,36.9 IC1.4 107.1,35.7 103.8,32.4 103.8,29.7 100.2,26.1 | IC1.7 112.5,30.3 112.5,35.7 IC1.2 112.8,36.9 114.3,36.9 IC1.1 114.9,35.7 117,33.6 117,20.7 116.4,20.7 ICSP1.3 | S5.S1 103.2,8.4 103.2,12.9 C18.1 102.6,14.1 99.6,17.1 99.6,20.7 C12.1 | v88.5,23.7 89.1,23.7 IC2.29 90.3,23.7 93.9,23.7 93.9,21 94.5,20.4 98.4,20.4 98.4,20.7 C12.1 | C28.1 91.8,34.5 92.4,33.9 92.4,33.6 93.9,33.6 C29.1 95.1,32.4 98.4,29.1 98.4,27.3 C13.1 99.6,26.7 100.2,26.1 | 100.2,26.1 100.2,21.6 99.6,21.6 C12.1 | T7.E 85.2,48.6 73.5,48.6 T1.E 72.6,48.3 72,47.7 72,46.8 71.7,46.5 67.2,46.5 67.2,47.4 66.9,47.7 61.5,47.7 | R14.1 63,40.2 63,42 R13.1 62.4,43.2 61.5,44.1 61.5,47.7 | 48,48.3 57,48.3 57,46.8 57.3,46.5 59.4,46.5 59.4,47.7 60,48.3 T2.E 60.9,48.3 61.5,47.7 | 48,48.3 47.4,48.3 T3.E | IC3.25 38.4,17.4 39,17.4 IC3.26 39,16.8 39,15.9 | 39,15.9 39,14.1 C15.1 39.3,12.9 39.3,8.4 S2.S1 | 35.4,18.6 35.7,18.6 35.7,18 IC3.21 35.7,16.8 35.7,15.9 39,15.9 | 35.4,18.6 33.9,18.6 33.6,18.3 33.6,18 IC3.18 33.6,16.8 33.6,16.2 32.4,15 29.4,15 | 35.4,18.6 35.4,22.8 36.3,23.7 36.3,24 IC3.7 | 35.4,48.3 43.5,48.3 43.5,46.8 46.5,43.8 49.5,43.8 49.5,43.2 R11.1 50.1,42 50.1,40.2 R12.1 | 35.4,48.3 34.8,48.3 T4.E | AUDIO.P$G 13.2,51.9 13.8,51.3 13.8,47.1 VIDEO.P$1 15.9,44.7 24.9,35.7 24.9,31.5
  Top 0.3: 24.9,31.5 24,30.6 24,27 C8.- 24,25.5 24,25.2 25.5,25.2 C4.2 26.7,24.9 27.9,24.9 C2.1 29.1,24.3 29.7,24.3 29.7,15.3 29.4,15 | 24.9,31.5 25.5,32.1 L3.2 | C6.2 24.6,18.6 23.4,18.6 C5.2 22.5,18 22.5,17.7 21,16.2 C7.1 21,15 21.9,14.1 21.9,5.7 VCC-GND.1 | S1.S1 28.2,8.4 28.2,12.9 C14.1 28.5,14.1 29.4,15 | v35.4,47.7 35.4,48.3 | v48,47.7 48,48.3 | v59.4,11.1 60,11.1
  Bottom 0.3: S3.S1 82.5,5.7 83.1,5.1 90.9,5.1 91.8,6 S4.S1 93,5.7 93.6,5.1 101.4,5.1 102.3,6 S5.S1 | 111.6,36 111.6,34.2 C11.1 | 111.6,36 111.9,36 IC1.2 | 111.6,36 110.1,36 IC1.3 | v88.5,23.7 85.2,23.7 C10.1 | S2.S1 39.6,8.1 41.4,9.9 56.1,9.9 57.3,11.1 C1.1 58.5,11.1 v59.4,11.1 | C9.1 35.4,21.6 35.4,22.2 15.6,22.2 11.4,18 11.4,15.3 12.3,15.3 USB.4 13.2,14.1 21.6,5.7 21.9,5.7 VCC-GND.1 22.8,5.4 23.4,6 27.9,6 S1.S1 | VIDEO.P$1 15.9,47.1 34.8,47.1 v35.4,47.7 v48,47.7
MCLR  (via drill 0.3)
  Top 0.3: C14.2 R10.1 32.7,12.9 32.7,9 33.3,8.4 S1.S2 | v84.9,15.9 84.9,16.5 IC2.18 | v114.9,11.4 114.9,17.7 ICSP1.1
  Bottom 0.3: v84.9,15.9 86.4,17.4 114.6,17.4 114.9,17.7 ICSP1.1 | v114.9,11.4 108,4.5 35.7,4.5 34.2,6 S1.S2
N$1  (via drill 0.3)
  Top 0.3: v19.5,18.6 20.7,18.6 C5.1 | v30.6,18 31.8,18 IC3.15
  Bottom 0.3: USB.3 13.2,17.7 14.1,18.6 v19.5,18.6 30,18.6 v30.6,18
N$2
  Top 0.3: IC2.30 94.5,24.6 94.5,21.9 Q1.2 95.4,21.9 95.4,22.5 98.4,22.5 C12.2
N$3
  Top 0.3: L1.2 18.6,22.8 18.6,16.2 C7.2 18.3,15 18.3,8.1 15.9,5.7 VCC-VCC.2
N$4  (via drill 0.3)
  Top 0.3: v31.8,26.1 31.8,25.2 IC3.14 | v50.1,26.4 50.1,27.3 R3.1
  Bottom 0.3: v31.8,26.1 32.1,26.4 v50.1,26.4
N$5  (via drill 0.3)
  Top 0.3: v33,20.1 33,18 IC3.17
  Bottom 0.3: v33,20.1 33.3,20.4 33.6,20.4 C9.2
N$6
  Top 0.3: T7.B 86.1,46.8 89.7,46.8 R15.1
N$7
  Top 0.3: T1.B 73.5,46.8 76.5,46.8 R16.1
N$8  (via drill 0.3)
  Top 0.3: T6.1 57.9,26.1 57.9,27.3 C3.2 57.6,27.3 v57,26.7 | v53.1,26.7 53.1,27 52.8,27.3 R3.2
  Bottom 0.3: v53.1,26.7 v57,26.7
N$9
  Top 0.3: T2.B 60,46.2 57.9,44.1 57.9,38.7 58.5,38.1 64.2,38.1 64.2,45.9 R17.1
N$10
  Top 0.3: T3.B 47.4,46.8 50.7,46.8 R18.1
N$11
  Top 0.3: T4.B 34.8,46.8 37.5,46.8 R19.1
N$12
  Top 0.3: TX.A 16.5,29.1 17.7,29.1 R1.1
N$13
  Top 0.3: RX.A R2.1
N$14  (via drill 0.3)
  Top 0.3: v16.8,26.1 14.4,28.5 TX.C | v37.2,22.8 36.9,22.5 36.9,18 IC3.23
  Bottom 0.3: v16.8,26.1 19.2,23.7 36.3,23.7 v37.2,22.8
N$15  (via drill 0.3)
  Top 0.3: v14.4,30.3 14.4,31.2 RX.C | v36.3,22.8 36.3,18 IC3.22
  Bottom 0.3: v14.4,30.3 14.4,22.8 v36.3,22.8
N$16
  Top 0.3: T7.C 84,47.7 86.7,47.7 86.7,51.9 DIS1.3 DIS1.8
N$17
  Top 0.3: T1.C 71.4,48 72,48.6 72,50.1 73.8,51.9 DIS2.3 74.1,54 74.1,67.2 DIS2.8
N$18
  Top 0.3: T2.C 58.8,48 59.4,48.6 59.4,50.7 60.6,51.9 DIS3.3 61.2,54 61.2,67.2 DIS3.8
N$19
  Top 0.3: T3.C 45.3,48 45.6,48.3 45.6,49.8 47.7,51.9 DIS4.3 DIS4.8
N$20
  Top 0.3: T4.C 32.7,48 33,48.3 33,50.1 34.8,51.9 DIS5.3 35.1,54 35.1,67.2 DIS5.8
N$21
  Top 0.3: FM.C 46.5,42.6 47.7,42.6 R11.2
N$22
  Top 0.3: TV.C 46.5,39.6 47.7,39.6 R12.2
N$23
  Top 0.3: MEM.C 59.4,42.6 60.6,42.6 R13.2
N$24
  Top 0.3: VCC-VCC.1 13.5,5.7 14.4,6.6 14.4,14.1 USB.1
N$25  (via drill 0.3)
  Top 0.3: v53.1,19.2 53.1,20.1 C19.2 | v54.9,18 54.6,17.7 54.6,12.6 53.4,11.4 IC4.16
  Bottom 0.3: v53.1,19.2 54.3,18 v54.9,18
N$26  (via drill 0.3)
  Top 0.3: v32.4,15.9 32.4,16.8 IC3.16 | v26.4,16.8 26.4,18 C6.1
  Bottom 0.3: v32.4,15.9 31.5,16.8 v26.4,16.8 15.3,16.8 USB.2
N$27  (via drill 0.3)
  Top 0.3: v51.6,26.1 51.6,21.3 C19.1 | v61.2,27.9 64.2,30.9 64.2,37.2 v66.3,39.3
  Bottom 0.3: v51.6,26.1 53.4,27.9 v61.2,27.9 | v66.3,39.3 66.6,39.6 84.9,39.6 85.5,40.2 90.6,40.2 90.9,39.9 90.9,36.9 88.8,36.9 IC5.14
N$28
  Top 0.3: C20.2 72.3,8.4 69.6,8.4 Q2.2 68.4,8.4 65.4,8.4 R28.2
N$29  (via drill 0.3)
  Top 0.3: C27.2 66.6,32.4 66.6,35.1 IC5.9 66.6,36.9 67.2,37.5 67.2,39.3 v65.4,41.1 | v27.9,44.1 16.2,55.8 AUDIO.P$R
  Bottom 0.3: v27.9,44.1 30.9,41.1 v65.4,41.1
N$30  (via drill 0.3)
  Top 0.3: C22.2 69.9,32.4 69.9,35.1 IC5.10 69.3,36.9 69,37.2 v69,41.1 | v21.6,59.1 13.2,59.1 AUDIO.P$L
  Bottom 0.3: v21.6,59.1 32.1,48.6 61.5,48.6 v69,41.1
N$31
  Bottom 0.3: IC5.12 78,35.1 76.8,33.9 16.5,33.9 15.9,34.5 VIDEO.P$2
N$32
  Top 0.3: C21.2 72.3,13.5 69.6,13.5 Q2.1 68.4,13.2 68.4,11.4 62.4,11.4 IC4.5
N$33
  Top 0.3: R28.1 64.2,9.9 62.4,9.9 IC4.4
N$34
  Top 0.3: IC2.31 90.3,25.5 94.5,25.5 94.5,26.1 Q1.1 95.4,26.1 95.4,25.5 98.4,25.5 C13.2
N$36
  Top 0.3: IC4.17 51.6,10.2 49.5,10.2 C26.+
N$38
  Top 0.3: C25.2 48.9,6.6 50.7,6.6 51.6,7.5 IC4.19
N$39
  Top 0.3: C25.1 48.9,8.4 51.6,8.4 51.6,8.7 IC4.18
N$40
  Top 0.3: C22.1 69.9,29.7 69.9,27.3 R29.1
N$41
  Top 0.3: C27.1 66.9,29.7 66.9,27.3 R30.1
N$42  (via drill 0.3)
  Top 0.3: R29.2 69.3,25.2 67.5,25.2 R30.2 66.3,24.6 66.3,19.2 v63.3,16.2 | v50.7,15.9 50.7,15.3 51.6,15.3 IC4.13
  Bottom 0.3: v50.7,15.9 51,16.2 v63.3,16.2
RA0  (via drill 0.3)
  Top 0.3: v86.4,24.6 86.4,20.7 85.5,19.8 85.5,17.7 IC2.19 | v88.2,24.9 88.5,25.2 88.5,27.6 89.4,28.5 89.4,32.7 90,33.3 90,35.4 91.5,36.9 91.5,45.9 R15.2
  Bottom 0.3: v86.4,24.6 86.7,24.9 v88.2,24.9
RA1  (via drill 0.3)
  Top 0.3: v75.6,19.2 75.3,19.5 75.3,33.9 76.8,35.4 76.8,44.1 78.6,45.9 R16.2 | v86.4,18.9 IC2.20
  Bottom 0.3: v86.4,18.9 84.6,18.9 84,19.5 75.9,19.5 v75.6,19.2
RA2  (via drill 0.3)
  Top 0.3: v87,15.9 87,16.5 IC2.21 | v76.5,15 71.4,20.1 v71.4,25.8 | v68.7,27 68.4,27.3 68.4,40.8 66.3,42.9 66.3,45.9 R17.2
  Bottom 0.3: v87,15.9 86.1,15 v76.5,15 | v71.4,25.8 70.2,27 v68.7,27
RA3  (via drill 0.3)
  Top 0.3: v88.2,13.5 88.2,16.5 IC2.22 | v58.5,18 54.6,21.9 54.6,44.7 53.4,45.9 R18.2
  Bottom 0.3: v88.2,13.5 87.9,13.2 70.8,13.2 66,18 v58.5,18
RA4  (via drill 0.3)
  Top 0.3: v89.1,11.1 89.1,18.9 IC2.23 | v47.1,9 46.2,9.9 46.2,34.2 45.9,34.5 45.9,37.5 45,38.4 45,43.5 42.6,45.9 40.5,45.9 R19.2
  Bottom 0.3: v89.1,11.1 88.2,10.2 57.3,10.2 56.1,9 v47.1,9
RA5  (via drill 0.3)
  Top 0.3: v32.1,19.2 32.1,20.1 33,21 33,24 IC3.12 | v55.5,17.1 58.5,14.1 58.5,7.2 60.6,5.1 90.3,5.1 90.3,17.7 90.9,18.3 90.9,19.8 IC2.24
  Bottom 0.3: v32.1,19.2 34.2,17.1 v55.5,17.1
RB0  (via drill 0.3)
  Top 0.3: v76.2,21.6 77.7,21.6 IC2.8 | v69.6,21.6 63.3,15.3 62.4,15.3 IC4.8
  Bottom 0.3: v69.6,21.6 v76.2,21.6
RB1  (via drill 0.3)
  Top 0.3: v30.9,24.6 30.9,23.4 32.1,23.4 32.4,23.7 32.4,24 IC3.13 | v80.1,21.6 78.9,20.4 IC2.9
  Bottom 0.3: v30.9,24.6 31.2,24.3 76.5,24.3 79.5,21.3 79.8,21.3 v80.1,21.6
RB2  (via drill 0.3)
  Top 0.3: v58.5,19.2 55.5,22.2 55.5,41.1 56.4,42 MEM.A | v75.6,18.3 77.1,19.8 IC2.10
  Bottom 0.3: v58.5,19.2 59.1,18.6 75.3,18.6 v75.6,18.3
RB3  (via drill 0.3)
  Top 0.3: v78.6,14.1 78.6,18.9 IC2.11
  Bottom 0.3: v78.6,14.1 78.9,14.4 114.3,14.4 117,17.1 117,23.7 116.4,23.7 ICSP1.6
RB4  (via drill 0.3)
  Top 0.3: v45.3,33 45.3,36.6 44.4,37.5 44.4,39 TV.A | v71.4,30.9 74.7,27.6 v74.7,17.7 | v81.3,15.9 81.6,16.2 IC2.14
  Bottom 0.3: v45.3,33 47.4,30.9 v71.4,30.9 | v74.7,17.7 76.5,15.9 v81.3,15.9
RB5  (via drill 0.3)
  Top 0.3: v43.8,25.5 41.7,27.6 41.7,40.2 43.5,42 FM.A | v80.4,24.9 82.2,23.1 82.2,17.7 IC2.15
  Bottom 0.3: v43.8,25.5 44.4,24.9 v80.4,24.9
RB6  (via drill 0.3)
  Top 0.3: v83.1,24.3 83.1,17.7 IC2.16
  Bottom 0.3: v83.1,24.3 84.6,25.8 93.9,25.8 96.6,23.1 114.9,23.1 ICSP1.5
RB7  (via drill 0.3)
  Top 0.3: IC2.17 v84,18.6
  Bottom 0.3: v84,18.6 84.6,18 111.3,18 114.9,21.6 ICSP1.4
RC0  (via drill 0.3)
  Top 0.3: v59.7,33 59.7,36 57.3,38.4 57.3,39 FRQ.A | v90.3,30.3 90.9,29.7 90.9,26.4 90.3,26.4 IC2.32
  Bottom 0.3: v59.7,33 60,32.7 78.3,32.7 79.8,31.2 89.4,31.2 v90.3,30.3
RC1  (via drill 0.3)
  Top 0.3: v88.5,21.9 87.3,23.1 87.3,28.2 IC2.35 | v100.5,18.9 104.4,15 104.4,14.1 C18.2 R9.1 107.4,12.9 107.4,8.7 107.7,8.4 S5.S2
  Bottom 0.3: v88.5,21.9 91.5,18.9 v100.5,18.9
RC2  (via drill 0.3)
  Top 0.3: v40.2,38.4 40.2,34.5 33.6,27.9 33.6,25.2 IC3.11 | v88.5,42.3 90.9,39.9 90.9,37.2 89.4,35.7 89.4,33.6 86.4,30.6 IC2.36
  Bottom 0.3: v40.2,38.4 42,40.2 80.4,40.2 82.5,42.3 v88.5,42.3
RC3  (via drill 0.3)
  Top 0.3: v93.3,30.9 91.8,32.4 C28.2 | SCL-SDA.1 116.4,44.4 117.3,43.5 117.3,41.7 114,38.4 111.3,38.4 111.3,31.8 109.8,30.3 IC1.6 | v64.2,19.8 62.4,18 IC4.10 | v84.6,19.8 85.5,20.7 85.5,28.2 IC2.37 85.5,29.4 85.5,36.6 84.3,37.8 84.3,38.7 83.7,39.3 R4.1 83.7,39.9 v87.9,44.1 | v45.3,19.8 45.3,24.9 44.4,25.8 44.4,34.8 44.1,35.1 IC5.4
  Bottom 0.3: v93.3,30.9 108.3,30.9 109.2,30 IC1.6 | v84.6,19.8 84.3,20.1 64.5,20.1 v64.2,19.8 64.2,20.1 45.6,20.1 v45.3,19.8 | v87.9,44.1 113.7,44.1 114.3,44.7 SCL-SDA.1
RC4  (via drill 0.3)
  Top 0.3: IC2.42 v81.6,30.3 81.6,35.4 80.4,36.6 80.4,37.5 78.6,39.3 R5.1 | v98.7,30 98.7,34.2 95.1,34.2 C29.2 | IC4.9 62.4,16.5 65.7,19.8 v65.7,25.8 65.7,31.2 v65.1,31.8 | SCL-SDA.2 114.3,42.3 110.7,38.7 110.7,33.6 107.4,30.3 IC1.5 | v48.3,33 48.3,35.1 IC5.5
  Bottom 0.3: IC1.5 106.8,30 v98.7,30 98.4,30 97.8,29.4 82.5,29.4 | v65.7,25.8 67.8,27.9 78,27.9 78.3,27.6 80.4,27.6 82.2,29.4 82.5,29.4 | v48.3,33 49.5,31.8 v65.1,31.8 | 82.5,29.4 v81.6,30.3
RC5  (via drill 0.3)
  Top 0.3: v39,27.3 39,25.2 IC3.3 | v80.1,30.3 80.7,29.7 80.7,29.4 IC2.43
  Bottom 0.3: v39,27.3 41.1,29.4 79.2,29.4 v80.1,30.3
RC6  (via drill 0.3)
  Top 0.3: v37.5,27.3 37.5,25.2 IC3.5 | v78.9,30.3 79.8,29.4 IC2.44
  Bottom 0.3: v37.5,27.3 40.2,30 78.6,30 v78.9,30.3
RC7  (via drill 0.3)
  Top 0.3: v40.2,27.3 40.2,25.2 IC3.1 | v78.3,28.5 78.3,27 IC2.1
  Bottom 0.3: v40.2,27.3 41.7,28.8 78,28.8 v78.3,28.5
RD0  (via drill 0.3)
  Top 0.3: v84.6,27.3 84.6,28.2 IC2.38 | v100.5,27.3 103.2,30 103.2,63.6 99.3,67.5 R20.1
  Bottom 0.3: v84.6,27.3 84.9,27.6 99,27.6 99.3,27.3 v100.5,27.3
RD1  (via drill 0.3)
  Top 0.3: v84.6,33.6 84.6,33 84,32.4 IC2.39 | v102.3,42.3 102,42.6 102,62.1 99.3,64.8 R21.1
  Bottom 0.3: v84.6,33.6 84.9,33.9 93.9,33.9 v102.3,42.3
RD2  (via drill 0.3)
  Top 0.3: v83.4,32.7 83.4,29.4 IC2.40 | v100.5,32.7 101.4,33.6 101.4,60.3 99.3,62.4 R22.1
  Bottom 0.3: v83.4,32.7 v100.5,32.7
RD3  (via drill 0.3)
  Top 0.3: v82.5,32.7 82.5,29.4 IC2.41 | v100.5,42.3 100.8,42.6 100.8,58.5 99.3,60 R23.1
  Bottom 0.3: v82.5,32.7 84.3,34.5 92.7,34.5 v100.5,42.3
RD4  (via drill 0.3)
  Top 0.3: v79.8,32.1 77.1,29.4 77.1,26.4 77.7,26.4 IC2.2 | v99.9,56.7 99.3,57.3 R24.1
  Bottom 0.3: v79.8,32.1 80.1,31.8 109.2,31.8 111.3,29.7 111.3,27.6 115.5,27.6 117.3,29.4 117.3,56.7 v99.9,56.7
RD5  (via drill 0.3)
  Top 0.3: v81,27.3 79.2,25.5 78.9,25.5 IC2.3 | v99.9,54.3 99.3,54.9 R25.1
  Bottom 0.3: v81,27.3 82.5,28.8 99,28.8 99.3,29.1 105,29.1 107.1,27 115.8,27 117.9,29.1 117.9,57.6 99.9,57.6 99,56.7 99,54.3 v99.9,54.3
RD6  (via drill 0.3)
  Top 0.3: v81.9,27.3 79.5,24.9 79.5,24.6 IC2.4 | v99.3,28.2 99.6,28.5 99.6,48.9 100.2,49.5 100.2,51.6 99.3,52.5 R26.1
  Bottom 0.3: v81.9,27.3 82.8,28.2 v99.3,28.2
RD7  (via drill 0.3)
  Top 0.3: v80.4,35.7 80.4,34.5 76.5,30.6 76.5,24 77.7,24 IC2.5 | v81.3,36.6 81.6,36.9 v81.6,40.5 | v93,41.4 98.4,46.8 98.4,49.8 R27.1
  Bottom 0.3: v80.4,35.7 v81.3,36.6 | v81.6,40.5 82.5,41.4 v93,41.4
RE0  (via drill 0.3)
  Top 0.3: R6.1 C15.2 | v87.3,20.7 89.1,20.7 IC2.25 | v43.5,20.7 43.5,14.1 R6.1 | S2.S2 43.8,8.4 43.5,8.7 43.5,12.9 R6.1
  Bottom 0.3: v43.5,20.7 v87.3,20.7
RE1  (via drill 0.3)
  Top 0.3: C16.2 R7.1 85.5,12.9 86.1,12.3 86.1,9 86.7,8.4 S3.S2 | v91.2,8.7 90.9,9 90.9,14.4 91.5,15 91.5,21.3 90.3,21.3 IC2.26
  Bottom 0.3: v91.2,8.7 90.6,8.1 87.6,8.1 S3.S2
RE2
  Top 0.3: IC2.27 93.3,22.2 93.3,14.1 C17.2 R8.1 96.6,12.9 96.6,9 97.2,8.4 S4.S2
SEGBUS0  (via drill 0.3)
  Top 0.3: DIS5.7 38.1,67.5 39.3,66.3 46.8,66.3 46.8,69 47.7,69.9 50.4,69.9 50.4,69.3 DIS4.7 51,67.2 v52.8,65.4 | v93.6,67.5 96.6,67.5 R20.2 | v65.7,65.4 63.9,67.2 DIS3.7 | v76.5,65.4 76.5,67.2 DIS2.7
  Bottom 0.3: v93.6,67.5 92.4,66.3 90.9,66.3 90,67.2 DIS1.7 89.1,67.2 87.6,65.7 76.5,65.7 | 76.5,65.7 66,65.7 v65.7,65.4 v52.8,65.4 | 76.5,65.7 v76.5,65.4
SEGBUS1
  Top 0.3: R21.2 96.6,66 93,66 93,66.6 92.4,67.2 DIS1.6 91.8,69.3 91.8,71.1 81.6,71.1 79.5,69 DIS2.6 78.6,69 77.7,69 76.8,69.9 66.3,69.9 66.3,69.3 DIS3.6 65.7,69 64.5,70.2 52.8,70.2 | 52.8,70.2 52.8,69.3 DIS4.6 | 52.8,70.2 52.8,70.5 42,70.5 40.5,69 DIS5.6
SEGBUS2  (via drill 0.3)
  Top 0.3: v95.1,61.8 95.1,62.7 96.6,62.7 R22.2 | v39.9,50.4 38.1,52.2 DIS5.4 | v48.6,50.4 50.1,51.9 DIS4.4 | v61.2,50.4 63,52.2 DIS3.4 | v74.7,50.4 76.2,51.9 DIS2.4
  Bottom 0.3: DIS1.4 90,53.7 90.9,54.6 95.1,54.6 v95.1,61.8 95.1,62.1 95.7,62.7 96,62.7 98.1,60.6 98.1,50.1 74.7,50.1 v74.7,50.4 v61.2,50.4 v48.6,50.4 v39.9,50.4
SEGBUS3  (via drill 0.3)
  Top 0.3: v96,59.4 96.6,60 R23.2
  Bottom 0.3: v96,59.4 96,51.3 85.5,51.3 84.9,51.9 DIS1.2 84,53.7 83.1,54.6 70.2,54.6 | 44.1,54.6 33.9,54.6 33,53.7 DIS5.2 | 44.1,54.6 45,53.7 DIS4.2 | 57,54.6 57.9,53.7 DIS3.2 | 44.1,54.6 57,54.6 | 70.2,54.6 71.1,53.7 DIS2.2 | 57,54.6 70.2,54.6
SEGBUS4  (via drill 0.3)
  Top 0.3: v96,61.8 94.5,60.3 94.5,58.5 96.6,58.5 R24.2
  Bottom 0.3: v96,61.8 97.5,60.3 97.5,50.7 84,50.7 82.5,52.2 DIS1.1 81.6,51.9 81,51.3 67.5,51.3 | 42,51.3 30.9,51.3 30.3,51.9 DIS5.1 | 42,51.3 42.6,51.9 DIS4.1 | 54.9,51.3 55.5,51.9 DIS3.1 | 42,51.3 54.9,51.3 | 67.5,51.3 68.4,52.2 DIS2.1 | 54.9,51.3 67.5,51.3
SEGBUS5
  Top 0.3: R25.2 96.6,56.1 93.6,56.1 93.6,64.5 90.6,67.5 90.6,69.3 89.4,70.5 84.6,70.5 84.6,69.3 DIS1.9
  Bottom 0.3: 44.1,66.3 33.9,66.3 33,67.2 DIS5.9 | 44.1,66.3 45,67.2 DIS4.9 | 56.7,66.3 57.9,67.5 DIS3.9 | 44.1,66.3 56.7,66.3 | 70.2,66.3 71.1,67.2 DIS2.9 | 56.7,66.3 70.2,66.3 | 70.2,66.3 83.1,66.3 84,67.2 DIS1.9
SEGBUS6
  Top 0.3: R26.2 96.6,53.7 93,53.7 93,62.4 88.2,67.2 88.2,69 87.3,69.9 85.5,69.9 85.5,66.9 84.9,66.3 82.2,66.3 82.2,67.2 DIS1.10
  Bottom 0.3: 41.7,69.9 31.2,69.9 30.3,69 DIS5.10 | 41.7,69.9 42.6,69 DIS4.10 | 54.6,69.9 55.5,69 DIS3.10 | 41.7,69.9 54.6,69.9 | 67.5,69.9 68.4,69 DIS2.10 | 54.6,69.9 67.5,69.9 | 67.5,69.9 80.7,69.9 81.6,69 DIS1.10
SEGBUS7  (via drill 0.3)
  Top 0.3: R27.2 96.6,51 92.4,51 92.4,51.9 DIS1.5 91.5,53.7 v89.7,55.5 | v42.3,55.5 40.5,53.7 DIS5.5 | v50.7,55.5 52.5,53.7 DIS4.5 | v63.9,55.5 65.7,53.7 DIS3.5 | v76.8,55.5 78.6,53.7 DIS2.5
  Bottom 0.3: v42.3,55.5 v50.7,55.5 v63.9,55.5 v76.8,55.5 v89.7,55.5
VCC  (via drill 0.3)
  Top 0.3: R5.2 78.6,41.4 82.5,41.4 R4.2 83.7,41.7 v85.2,43.2 | v79.5,22.2 IC2.7 | v88.5,22.8 89.1,22.8 IC2.28 | R8.2 98.4,12.9 101.7,9.6 101.7,5.7 102.3,5.1 109.2,5.1 109.2,12.9 R9.2 109.2,13.2 114.3,18.3 | 114.3,18.3 114.9,18.9 ICSP1.2 | v98.7,19.8 98.4,19.5 98.4,14.1 R8.2 | 114.3,18.3 114.3,27.9 114.6,28.2 IC1.8 | R6.2 44.4,14.1 v44.4,15 44.4,24 41.1,27.3 41.1,38.4 37.2,42.3 L2.1 | v33.6,9.6 33.6,12.9 R10.2 | C3.1 60,27.3 T6.3 v60,13.8 60.6,13.8 IC4.7 | v87,12 87,12.9 R7.2 | v97.5,12 97.5,12.9 R8.2
  Bottom 0.3: IC1.8 114.3,30 113.4,30.9 112.5,30.9 111.6,31.8 C11.2 110.4,32.7 108.6,32.7 108.6,37.5 102.9,43.2 v85.2,43.2 | v79.5,22.2 79.8,22.5 82.8,22.5 C10.2 83.1,22.5 83.7,21.9 87.6,21.9 v88.5,22.8 88.8,22.8 91.8,19.8 v98.7,19.8 | VCC-GND.2 20.1,3.6 21,2.7 26.7,2.7 v33.6,9.6 33.9,9.6 39,14.7 44.4,14.7 | 44.4,14.7 56.4,14.7 57.3,13.8 C1.2 58.5,13.8 v60,13.8 60.3,13.8 61.8,12.3 86.7,12.3 v87,12 v97.5,12 | 44.4,14.7 v44.4,15
VCCUSB  (via drill 0.3)
  Top 0.3: v56.4,23.4 56.4,23.7 57.6,23.7 T6.2 | v38.4,23.4 38.4,24 IC3.4 | R2.2 20.1,30.9 20.1,29.7 R1.2 20.1,28.5 20.1,24.3 | 20.1,24.3 21.9,24.3 21.9,24 C8.+ 24,23.4 25.5,23.4 C4.1 26.7,23.1 27.9,23.1 C2.2 27.9,22.8 v27.9,20.1 27.9,17.4 27,16.5 27,5.1 34.2,5.1 35.1,6 35.1,16.8 IC3.20 | 20.1,24.3 18.6,24.3 L1.1
  Bottom 0.3: v56.4,23.4 v38.4,23.4 38.4,19.2 33,19.2 32.1,20.1 v27.9,20.1

### Text on the board
tPlace: MHz | BUZZRADIO 1.1